# Altium schematic sheet RK3588_TYPE_C.SchDoc
size 594 x 420 mm; SheetNumber: 6; SheetTotal: 23
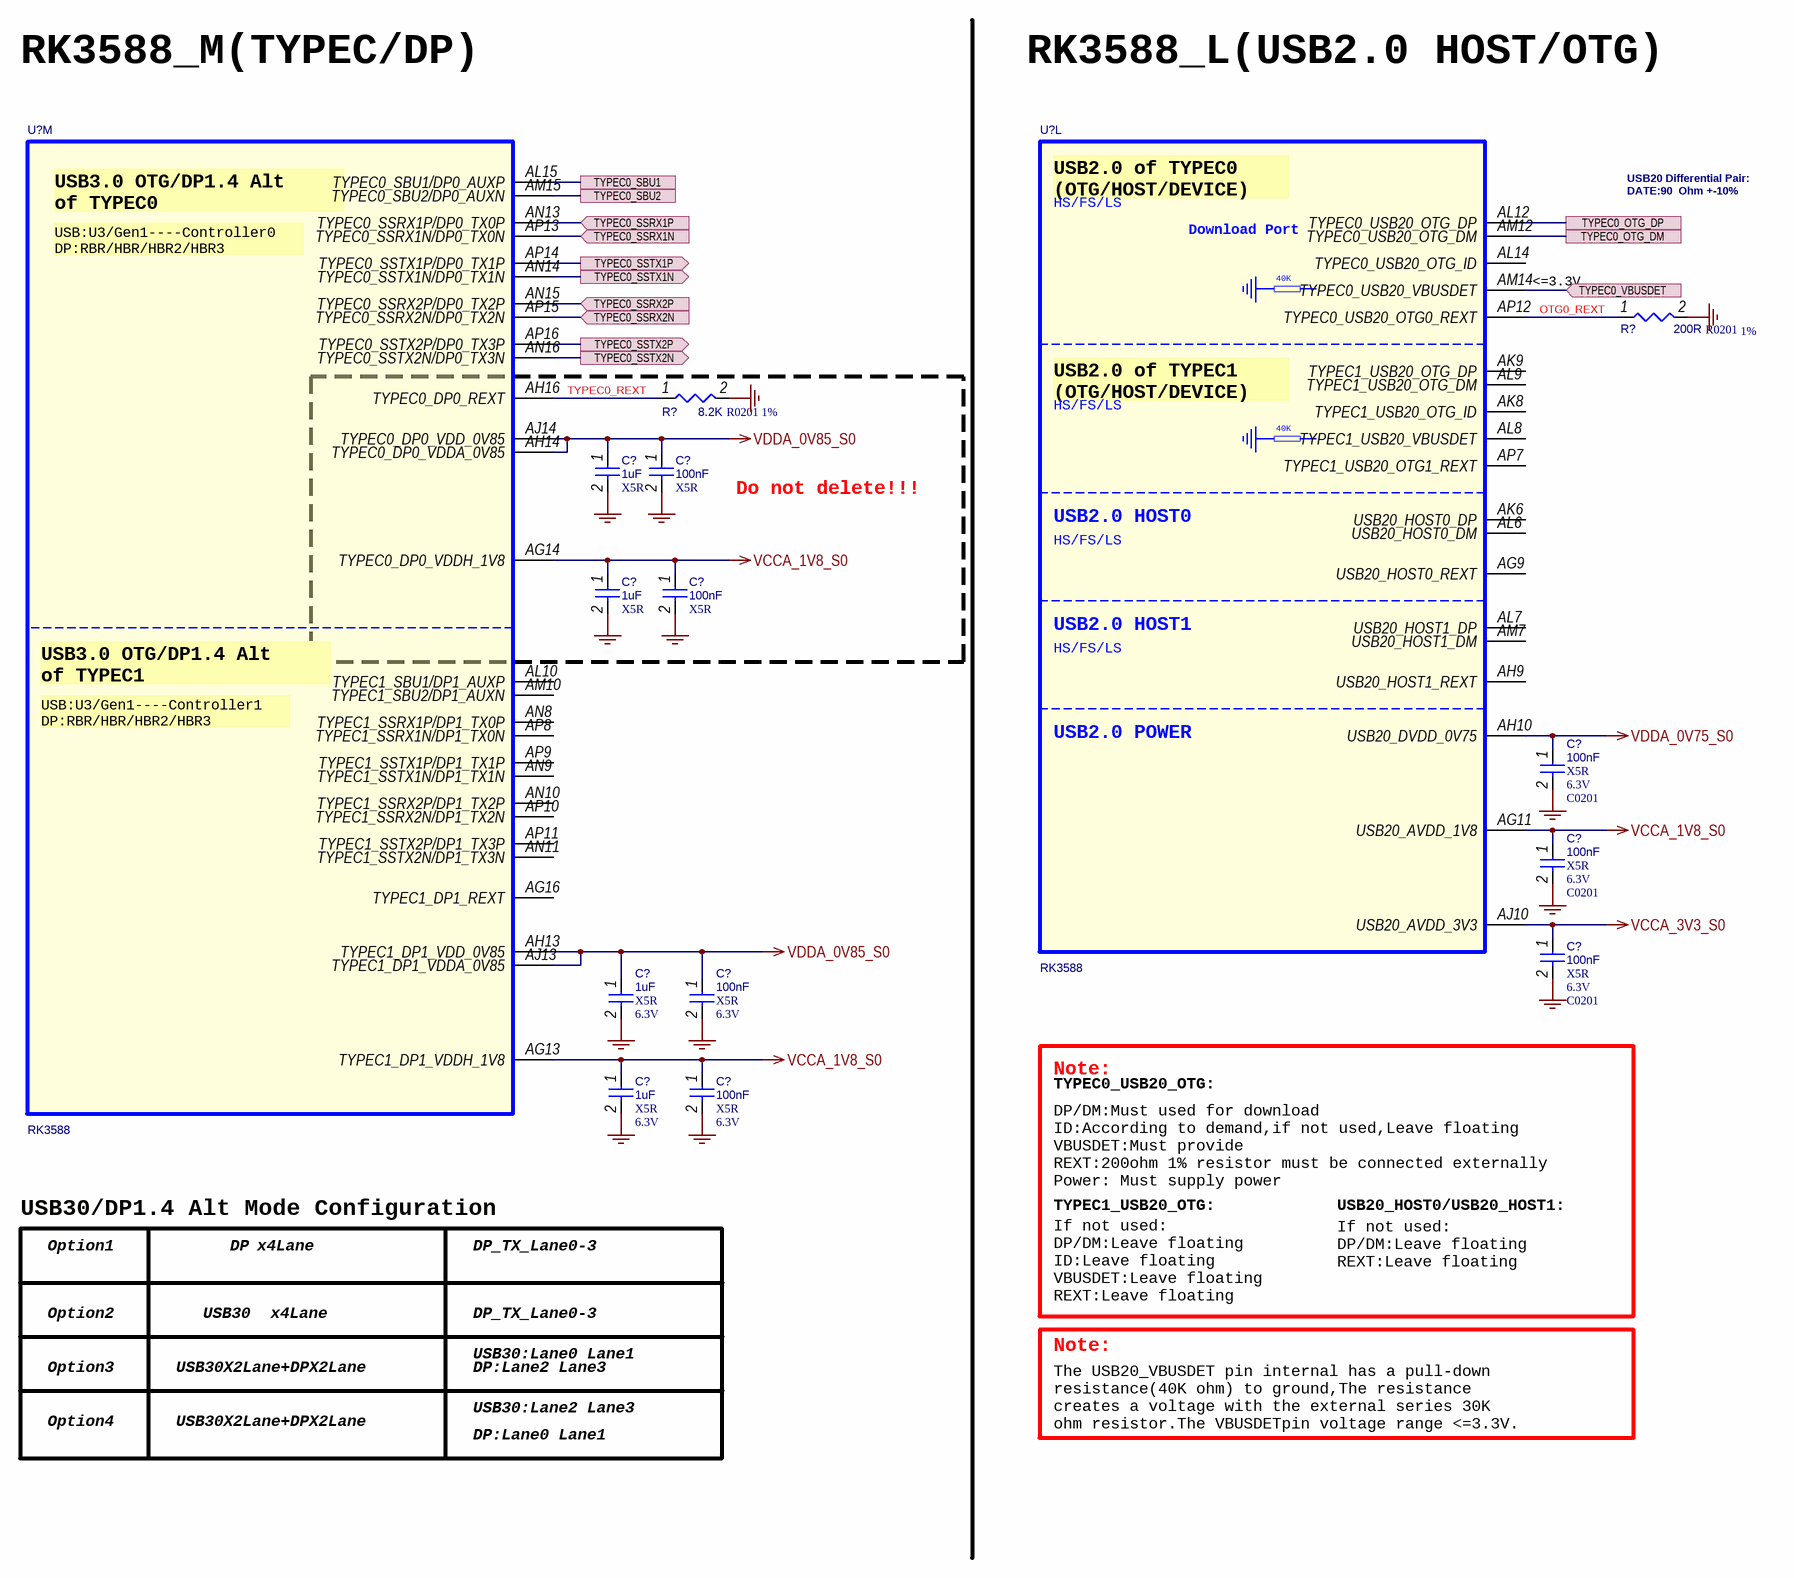
[diagram p0: RK3588_TYPE_C.SchDoc]

## Parts
(Parts that share a designator on the sheet are numbered #1, #2 ... from top to bottom, then left to right.)
C?#1  1uF  Dielectric: X5R  [C0201]
C?#2  100nF  Dielectric: X5R  [C0201]
C?#3  1uF  Dielectric: X5R  [C0201]
C?#4  100nF  Dielectric: X5R  [C0201]
C?#5  100nF  Dielectric: X5R  Voltage: 6.3V  [C0201]
C?#6  100nF  Dielectric: X5R  Voltage: 6.3V  [C0201]
C?#7  100nF  Dielectric: X5R  Voltage: 6.3V  [C0201]
C?#8  1uF  Dielectric: X5R  Voltage: 6.3V  [C0201]
C?#9  100nF  Dielectric: X5R  Voltage: 6.3V  [C0201]
C?#10  1uF  Dielectric: X5R  Voltage: 6.3V  [C0201]
C?#11  100nF  Dielectric: X5R  Voltage: 6.3V  [C0201]
R?#1  200R  Tolerance: 1%  PCB Footprint: R0201  [R0402]
R?#2  8.2K  Tolerance: 1%  PCB Footprint: R0201  [R0402]
U?#1  RK3588  [BGA1088_23R00X23R00X2R00]  (part M of 26)
U?#2  RK3588  [BGA1088_23R00X23R00X2R00]  (part L of 26)

## Blocks framed on the sheet
Do not delete!!!: C?#1-C?#4 R?#2 U?#1

## Ports
TYPEC0_OTG_DM (see PORT_TYPE_C[2B]), TYPEC0_OTG_DP (see PORT_TYPE_C[2B]), TYPEC0_SBU1 (see PORT_TYPE_C[2A]), TYPEC0_SBU2 (see PORT_TYPE_C[2B]), TYPEC0_SSRX1N (in, see PORT_TYPE_C[2B]), TYPEC0_SSRX1P (in, see PORT_TYPE_C[2B]), TYPEC0_SSRX2N (in, see PORT_TYPE_C[2B]), TYPEC0_SSRX2P (in, see PORT_TYPE_C[2B]), TYPEC0_SSTX1N (out, see PORT_TYPE_C[2B]), TYPEC0_SSTX1P (out, see PORT_TYPE_C[2B]), TYPEC0_SSTX2N (out, see PORT_TYPE_C[2B]), TYPEC0_SSTX2P (out, see PORT_TYPE_C[2B]), TYPEC0_VBUSDET (in, see PORT_TYPE_C[2C])

## Nets
GND: C?#1.2 C?#2.2 C?#3.2 C?#4.2 C?#5.2 C?#6.2 C?#7.2 C?#8.2 C?#9.2 C?#10.2 C?#11.2 R?#1.2 R?#2.2
VCCA_1V8_S0: C?#3.1 C?#4.1 C?#6.1 C?#10.1 C?#11.1 U?#1.AG13(TYPEC1_DP1_VDDH_1V8) U?#1.AG14(TYPEC0_DP0_VDDH_1V8) U?#2.AG11(USB20_AVDD_1V8)
VCCA_3V3_S0: C?#7.1 U?#2.AJ10(USB20_AVDD_3V3)
VDDA_0V75_S0: C?#5.1 U?#2.AH10(USB20_DVDD_0V75)
VDDA_0V85_S0: C?#1.1 C?#2.1 C?#8.1 C?#9.1 U?#1.AH13(TYPEC1_DP1_VDD_0V85) U?#1.AH14(TYPEC0_DP0_VDDA_0V85) U?#1.AJ13(TYPEC1_DP1_VDDA_0V85) U?#1.AJ14(TYPEC0_DP0_VDD_0V85)
OTG0_REXT: R?#1.1 U?#2.AP12(TYPEC0_USB20_OTG0_REXT)
TYPEC0_OTG_DM: U?#2.AM12(TYPEC0_USB20_OTG_DM) ; port TYPEC0_OTG_DM
TYPEC0_OTG_DP: U?#2.AL12(TYPEC0_USB20_OTG_DP) ; port TYPEC0_OTG_DP
TYPEC0_REXT: R?#2.1 U?#1.AH16(TYPEC0_DP0_REXT)
TYPEC0_SBU1: U?#1.AL15(TYPEC0_SBU1/DP0_AUXP) ; port TYPEC0_SBU1
TYPEC0_SBU2: U?#1.AM15(TYPEC0_SBU2/DP0_AUXN) ; port TYPEC0_SBU2
TYPEC0_SSRX1N: U?#1.AP13(TYPEC0_SSRX1N/DP0_TX0N) ; port TYPEC0_SSRX1N
TYPEC0_SSRX1P: U?#1.AN13(TYPEC0_SSRX1P/DP0_TX0P) ; port TYPEC0_SSRX1P
TYPEC0_SSRX2N: U?#1.AP15(TYPEC0_SSRX2N/DP0_TX2N) ; port TYPEC0_SSRX2N
TYPEC0_SSRX2P: U?#1.AN15(TYPEC0_SSRX2P/DP0_TX2P) ; port TYPEC0_SSRX2P
TYPEC0_SSTX1N: U?#1.AN14(TYPEC0_SSTX1N/DP0_TX1N) ; port TYPEC0_SSTX1N
TYPEC0_SSTX1P: U?#1.AP14(TYPEC0_SSTX1P/DP0_TX1P) ; port TYPEC0_SSTX1P
TYPEC0_SSTX2N: U?#1.AN16(TYPEC0_SSTX2N/DP0_TX3N) ; port TYPEC0_SSTX2N
TYPEC0_SSTX2P: U?#1.AP16(TYPEC0_SSTX2P/DP0_TX3P) ; port TYPEC0_SSTX2P
TYPEC0_VBUSDET: U?#2.AM14(TYPEC0_USB20_VBUSDET) ; port TYPEC0_VBUSDET

Not connected (* = marked no-connect by the designer): U?#1 AG16(TYPEC1_DP1_REXT) AL10(TYPEC1_SBU1/DP1_AUXP) AM10(TYPEC1_SBU2/DP1_AUXN) AN8(TYPEC1_SSRX1P/DP1_TX0P) AN9(TYPEC1_SSTX1N/DP1_TX1N) AN10(TYPEC1_SSRX2P/DP1_TX2P) AN11(TYPEC1_SSTX2N/DP1_TX3N) AP8(TYPEC1_SSRX1N/DP1_TX0N) AP9(TYPEC1_SSTX1P/DP1_TX1P) AP10(TYPEC1_SSRX2N/DP1_TX2N) AP11(TYPEC1_SSTX2P/DP1_TX3P); U?#2 AG9(USB20_HOST0_REXT) AH9(USB20_HOST1_REXT) AK6(USB20_HOST0_DP) AK8(TYPEC1_USB20_OTG_ID) AK9(TYPEC1_USB20_OTG_DP) AL6(USB20_HOST0_DM) AL7(USB20_HOST1_DP) AL8(TYPEC1_USB20_VBUSDET) AL9(TYPEC1_USB20_OTG_DM) AL14(TYPEC0_USB20_OTG_ID) AM7(USB20_HOST1_DM) AP7(TYPEC1_USB20_OTG1_REXT)

## Notes on the sheet
- RK3588_M(TYPEC/DP)
- RK3588_L(USB2.0 HOST/OTG)
- USB20 Differential Pair:
  DATE:90  Ohm +-10%
- <=3.3V
- Note:
- TYPEC0_USB20_OTG:
- TYPEC1_USB20_OTG:
- DP/DM:Must used for download
  ID:According to demand,if not used,Leave floating
  VBUSDET:Must provide
  REXT:200ohm 1% resistor must be connected externally
  Power: Must supply power
- USB20_HOST0/USB20_HOST1:
- USB30/DP1.4 Alt Mode Configuration
- Option1
- DP
- x4Lane
- DP_TX_Lane0-3
- If not used:
  DP/DM:Leave floating
  REXT:Leave floating
- Option2
- USB30
- If not used:
  DP/DM:Leave floating
  ID:Leave floating
  VBUSDET:Leave floating
  REXT:Leave floating
- Option3
- USB30X2Lane+DPX2Lane
- USB30:Lane0 Lane1
- DP:Lane2 Lane3
- Option4
- USB30:Lane2 Lane3
- DP:Lane0 Lane1
- The USB20_VBUSDET pin internal has a pull-down
  resistance(40K ohm) to ground,The resistance
  creates a voltage with the external series 30K
  ohm resistor.The VBUSDETpin voltage range <=3.3V.
- 420x594
- Формат А2
- (in symbol SOC_RK3588, part L) USB2.0 of TYPEC0 / (OTG/HOST/DEVICE); HS/FS/LS; Download Port; 40K; USB2.0 of TYPEC1 / (OTG/HOST/DEVICE); USB2.0 HOST0; USB2.0 HOST1; USB2.0 POWER
- (in symbol SOC_RK3588, part M) USB3.0 OTG/DP1.4 Alt / of TYPEC0; USB:U3/Gen1----Controller0 / DP:RBR/HBR/HBR2/HBR3; USB3.0 OTG/DP1.4 Alt / of TYPEC1; USB:U3/Gen1----Controller1 / DP:RBR/HBR/HBR2/HBR3

## Library data of the parts
C?#1 = CAP NP_Dup1: cap,1.00uF,+/-20%,6.3V,X5R,C0201; Part Reference: C1400; Manufacturer: TDK; RK PN: C0603X5R0J105M030BC; Priority: A; Tolerance: 20%; Value: 1uF; Part Type: C0201; Manufacturer PN: C0603X5R0J105M030BC; Created by: JJJ
C?#2 = CAP NP_Dup1: cap,100.00nF,+/-10%,6.3V,X5R,C0201; Part Reference: C1401; Manufacturer: TDK; RK PN: C0603X5R0J104K030BC; Priority: A; Tolerance: 10%; Value: 100nF; Part Type: C0201; Manufacturer PN: C0603X5R0J104K030BC; Created by: JJJ
C?#3 = CAP NP_Dup1: cap,1.00uF,+/-20%,6.3V,X5R,C0201; Part Reference: C1402; Manufacturer: TDK; RK PN: C0603X5R0J105M030BC; Priority: A; Tolerance: 20%; Value: 1uF; Part Type: C0201; Manufacturer PN: C0603X5R0J105M030BC; Created by: JJJ
C?#4 = CAP NP_Dup1: cap,100.00nF,+/-10%,6.3V,X5R,C0201; Part Reference: C1403; Manufacturer: TDK; RK PN: C0603X5R0J104K030BC; Priority: A; Tolerance: 10%; Value: 100nF; Part Type: C0201; Manufacturer PN: C0603X5R0J104K030BC; Created by: JJJ
C?#5 = CAP NP_Dup1: cap,100.00nF,+/-10%,6.3V,X5R,C0201; Part Reference: C1408; Manufacturer PN: C0603X5R0J104K030BC; Manufacturer: TDK; Tolerance: 10%; Priority: A; PCB Footprint: C0201; Value: 100nF; Created by: JJJ; Part Type: C0201; RK PN: C0603X5R0J104K030BC
C?#6 = CAP NP_Dup1: cap,100.00nF,+/-10%,6.3V,X5R,C0201; Part Reference: C1409; Manufacturer PN: C0603X5R0J104K030BC; Manufacturer: TDK; Tolerance: 10%; Priority: A; PCB Footprint: C0201; Value: 100nF; Created by: JJJ; Part Type: C0201; RK PN: C0603X5R0J104K030BC
C?#7 = CAP NP_Dup1: cap,100.00nF,+/-10%,6.3V,X5R,C0201; Part Reference: C1410; Manufacturer PN: C0603X5R0J104K030BC; Manufacturer: TDK; Tolerance: 10%; Priority: A; PCB Footprint: C0201; Value: 100nF; Created by: JJJ; Part Type: C0201; RK PN: C0603X5R0J104K030BC
C?#8 = CAP NP_Dup1: cap,1.00uF,+/-20%,6.3V,X5R,C0201; Part Reference: C1404; Manufacturer PN: C0603X5R0J105M030BC; Manufacturer: TDK; Tolerance: 20%; Priority: A; Value: 1uF; Created by: JJJ; Part Type: C0201; RK PN: C0603X5R0J105M030BC
C?#9 = CAP NP_Dup1: cap,100.00nF,+/-10%,6.3V,X5R,C0201; Part Reference: C1405; Manufacturer: TDK; RK PN: C0603X5R0J104K030BC; Priority: A; Tolerance: 10%; Value: 100nF; Part Type: C0201; Manufacturer PN: C0603X5R0J104K030BC; Created by: JJJ
C?#10 = CAP NP_Dup1: cap,1.00uF,+/-20%,6.3V,X5R,C0201; Part Reference: C1406; Manufacturer PN: C0603X5R0J105M030BC; Manufacturer: TDK; Tolerance: 20%; Priority: A; Value: 1uF; Created by: JJJ; Part Type: C0201; RK PN: C0603X5R0J105M030BC
C?#11 = CAP NP_Dup1: cap,100.00nF,+/-10%,6.3V,X5R,C0201; Part Reference: C1407; Manufacturer PN: C0603X5R0J104K030BC; Manufacturer: TDK; Tolerance: 10%; Priority: A; Value: 100nF; Created by: JJJ; Part Type: C0201; RK PN: C0603X5R0J104K030BC
R?#1 = RESISTOR_Dup2: НЁУГєсД¤µзЧи,200R,+/-1%,R0201,1/20W.; Part Reference: R1405; Manufacturer PN: RC0201FR-07200RL; Manufacturer: YAGEO; Wattage: 1/20W; Priority: A; Value: 200R; Created by: YTL; Part Type: НЁУГєсД¤µзЧи; RK PN: RC0201FR-07200RL
R?#2 = RESISTOR_Dup2: НЁУГєсД¤µзЧи,8K2,+/-1%,R0201,1/20W.; Part Reference: R1402; Manufacturer: YAGEO; RK PN: RC0201FR-078K2L; Priority: A; Wattage: 1/20W; Value: 8.2K; Part Type: НЁУГєсД¤µзЧи; Manufacturer PN: RC0201FR-078K2L; Created by: YTL
U?#1 U?#2 = SOC_RK3588: ROCKCHIP SOC; Part Reference: U1000; Manufacturer: Rockchip (ИрРѕОў); SWAP_INFO: (S1+S2+S3+S4+S5+S6+S7+S8+S9+S10+S11+S12+S13+S14+S15+S16+S17+S18+S19+S20+S21+S22+S23+S24+S25+S26); SPLIT_INST: TRUE; Priority: A; Value: RK3588; PCB Footprint: BGA1088_23R00X23R00X2R00; Created by: YWQ; Manufacturer PN: RK3588; Part Type: SOC; RK PN: RK3588